# EAGLE design mcuboard (EAGLE 7.1.0)
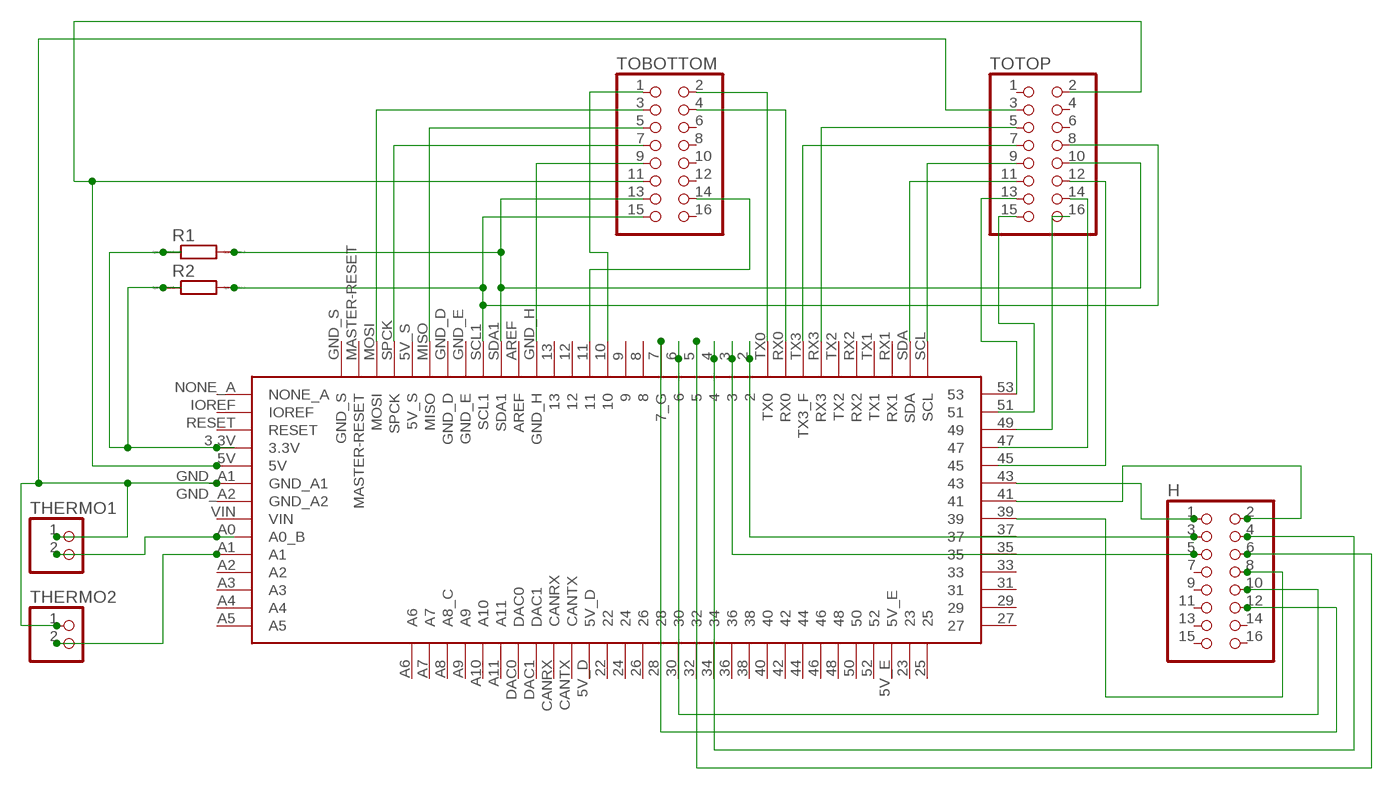
[diagram p0: schematic, sheet 1]

## Parts
H  PINHD-2X8  [2X08]
R1  R-EU_0207_12  [0207/12]
R2  R-EU_0207_12  [0207/12]
THERMO1  PINHD-1X2  [1X02]
THERMO2  PINHD-1X2  [1X02]
TOBOTTOM  PINHD-2X8  [2X08]
TOTOP  PINHD-2X8  [2X08]
U$1  IDUINO1  [IDUINO_PAC]

## Nets
N$1: TOBOTTOM.7 U$1.SPCK
N$2: TOBOTTOM.3 U$1.MOSI
N$3: TOBOTTOM.5 U$1.MISO
N$4: TOBOTTOM.9 U$1.GND_H
N$5: TOBOTTOM.11 TOTOP.2 U$1.5V
N$6: R1.2 TOBOTTOM.13 TOTOP.10 U$1.SDA1
N$7: R2.2 TOBOTTOM.15 TOTOP.8 U$1.SCL1
N$8: TOBOTTOM.2 U$1.TX0
N$9: THERMO1.1 THERMO2.1 TOTOP.3 U$1.GND_A1
N$10: TOBOTTOM.4 U$1.RX0
N$11: TOBOTTOM.14 U$1.11
N$12: TOBOTTOM.1 U$1.10
N$13: TOTOP.5 U$1.RX3
N$14: TOTOP.7 U$1.TX3(TX3_F)
N$15: TOTOP.9 U$1.SCL
N$16: TOTOP.11 U$1.SDA
N$17: R1.1 R2.1 U$1.3.3V
N$18: TOTOP.13 U$1.53
N$19: TOTOP.15
N$20: TOTOP.16 U$1.49
N$21: TOTOP.14
N$22: TOTOP.12
N$23: H.1 U$1.43
N$24: H.8 U$1.39
N$25: H.3 U$1.2
N$26: H.5 U$1.3
N$27: H.4 U$1.4
N$28: THERMO1.2 U$1.A0(A0_B)
N$29: H.2 U$1.41
N$30: H.10 U$1.6
N$31: H.12 U$1.7(7_G)
N$32: THERMO2.2 U$1.A1
N$33: H.6 U$1.5
Unconnected: H.7 H.9 H.11 H.13 H.14 H.15 H.16 TOBOTTOM.6 TOBOTTOM.8 TOBOTTOM.10 TOBOTTOM.12 TOBOTTOM.16 TOTOP.1 TOTOP.4 TOTOP.6 U$1.5V_D U$1.5V_E U$1.5V_S U$1.8 U$1.9 U$1.12 U$1.13 U$1.22 U$1.23 U$1.24 U$1.25 U$1.26 U$1.27 U$1.28 U$1.29 U$1.30 U$1.31 U$1.32 U$1.33 U$1.34 U$1.35 U$1.36 U$1.37 U$1.38 U$1.40 U$1.42 U$1.44 U$1.45 U$1.46 U$1.47 U$1.48 U$1.50 U$1.51 U$1.52 U$1.A2 U$1.A3 U$1.A4 U$1.A5 U$1.A6 U$1.A7 U$1.A8(A8_C) U$1.A9 U$1.A10 U$1.A11 U$1.AREF U$1.CANRX U$1.CANTX U$1.DAC0 U$1.DAC1 U$1.GND_A2 U$1.GND_D U$1.GND_E U$1.GND_S U$1.IOREF U$1.MASTER-RESET U$1.NONE_A U$1.RESET U$1.RX1 U$1.RX2 U$1.TX1 U$1.TX2 U$1.VIN

## Library data of the parts
H TOBOTTOM TOTOP = pinhead:PINHD-2X8: PIN HEADER
R1 R2 = resistor:R-EU_: RESISTOR, European symbol; SPICEPREFIX: R
THERMO1 THERMO2 = pinhead:PINHD-1X2: PIN HEADER
U$1 = iduino:IDUINO

## Board
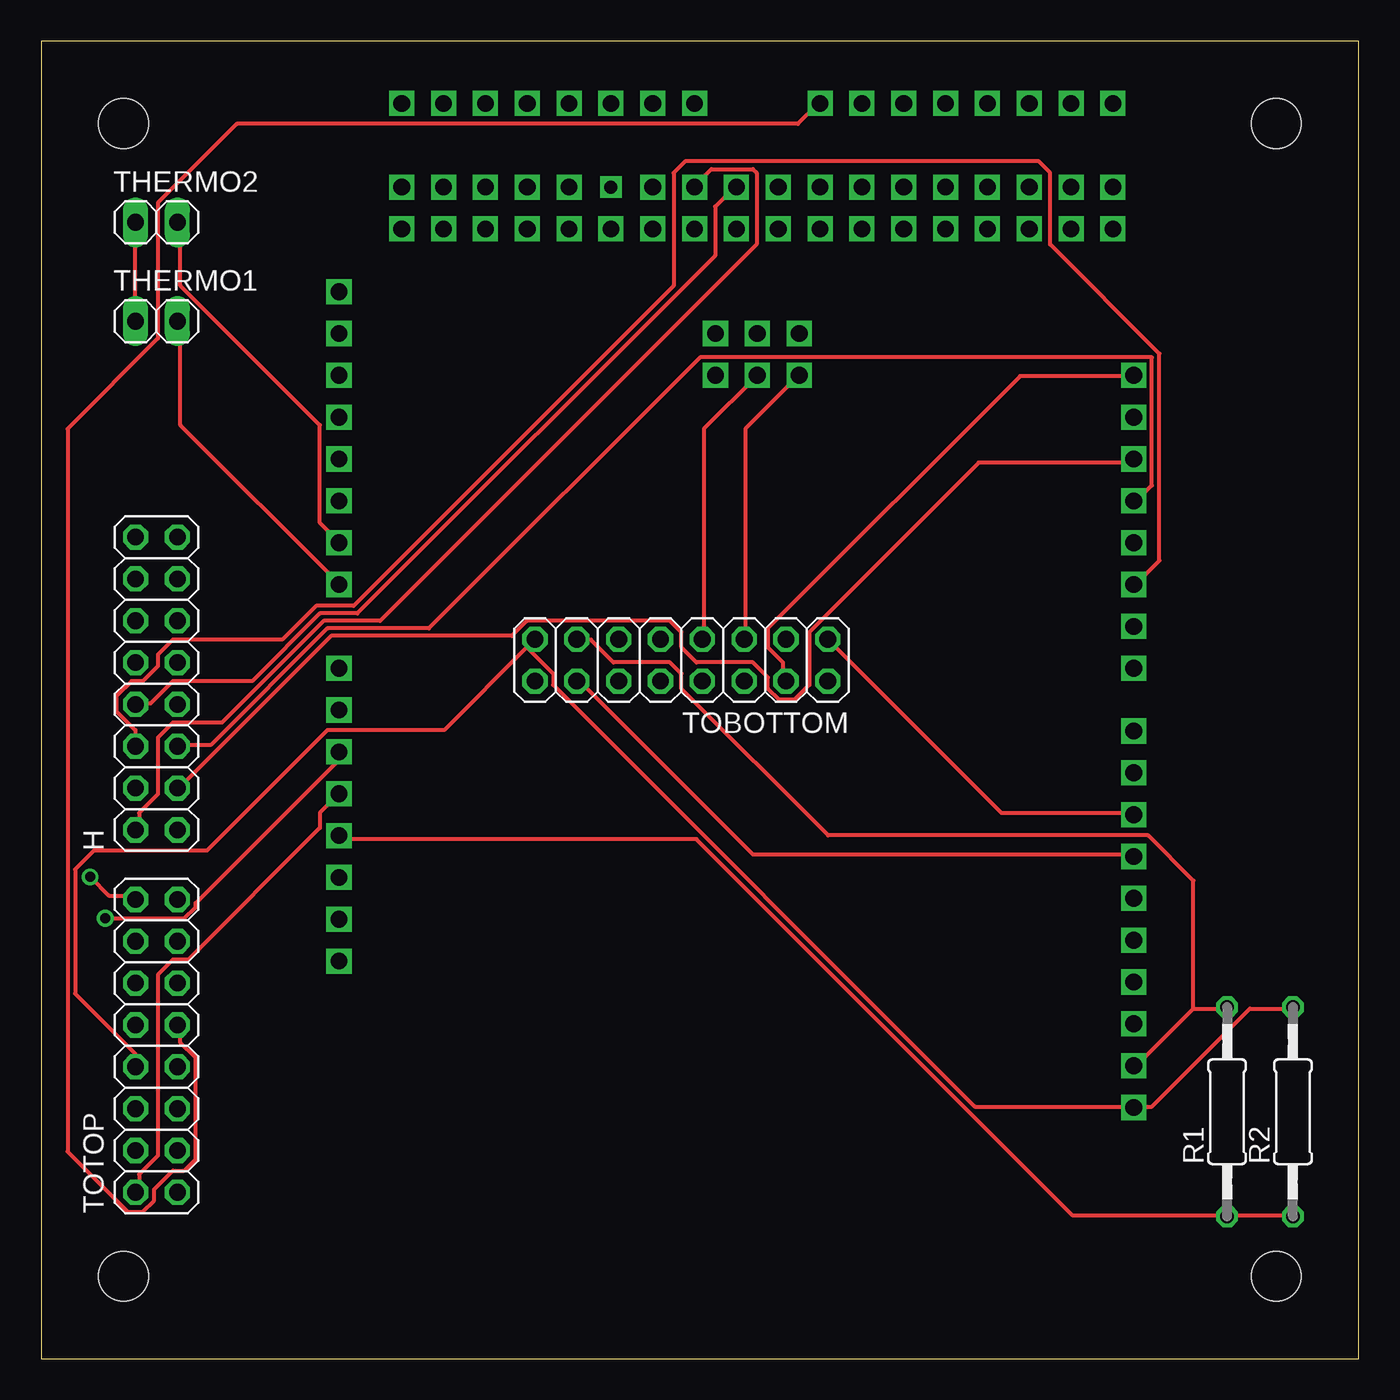
[diagram p1: board, top side]
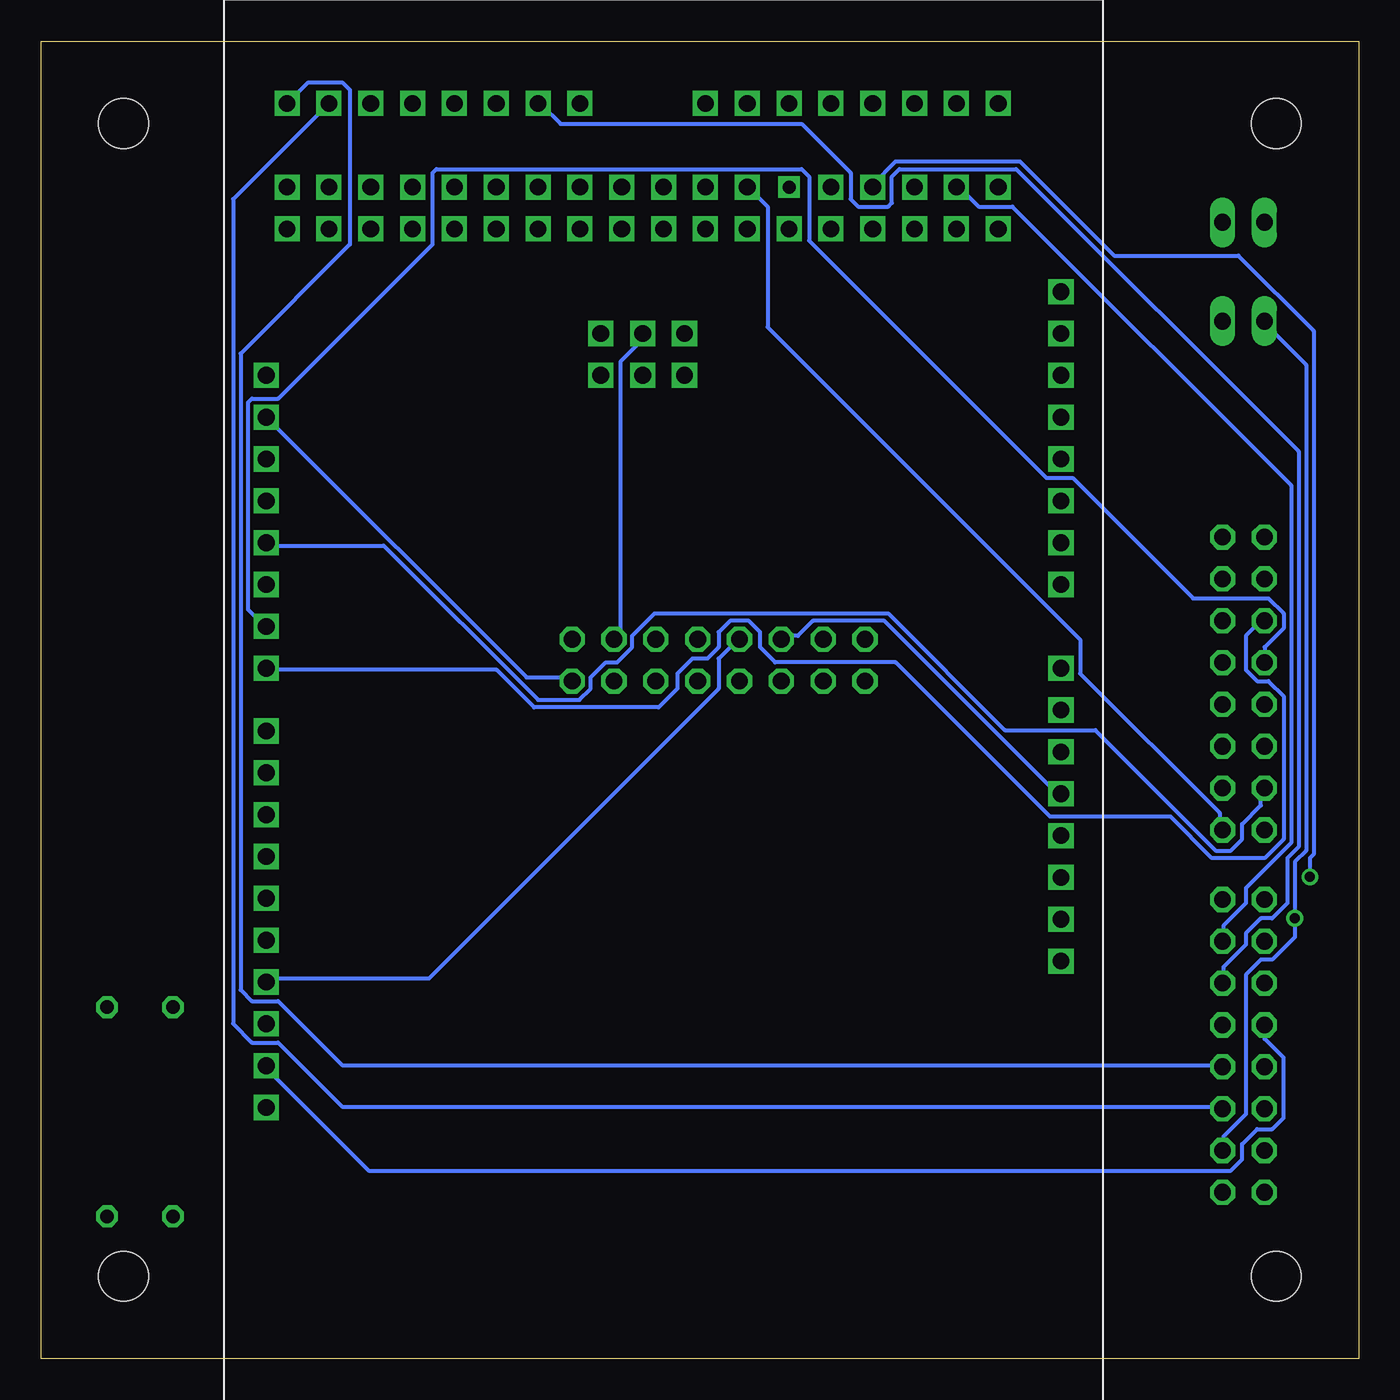
[diagram p2: board, bottom side, seen from below]

Size 80 x 80 mm. Coordinates in mm from the lower left corner, seen from the top.
Outline: 0,0 80,0 80,80 0,80 0,0
Copper layers (1*16): Top 0.035mm / dielectric 1.5mm / Bottom 0.035mm
Design rules "default": minimum track width 10mil, minimum drill 24mil, track to track 8mil, track to pad 8mil, pad to pad 8mil, via to via 8mil, smd to smd 8mil, copper to edge 40mil, drill to drill 8mil, minimum pad ring 10mil, minimum via ring 8mil, stop-mask expansion 4mil, vias tented up to drill 0mil, thermal gap 10mil
Holes 3 mm at 5,75 75,75 75,5 5,5

### Footprints (pad centres in the part's own frame; a part is rotated, then mirrored left to right if it is on the bottom)
2X08 = drill 1.016 octagon: 1 -8.89,-1.27; 2 -8.89,1.27; 3 -6.35,-1.27; 4 -6.35,1.27; 5 -3.81,-1.27; 6 -3.81,1.27; 7 -1.27,-1.27; 8 -1.27,1.27; 9 1.27,-1.27; 10 1.27,1.27; 11 3.81,-1.27; 12 3.81,1.27; 13 6.35,-1.27; 14 6.35,1.27; 15 8.89,-1.27; 16 8.89,1.27
0207/12 = drill 0.813 octagon: 1 -6.35,0; 2 6.35,0
1X02 = drill 1.016 long: 1 -1.27,0; 2 1.27,0
IDUINO_PAC = drill 1.016 square: 2 12.7,6.35; 3 10.16,6.35; 3.3V -10.16,-41.91; 4 7.62,6.35; 5 5.08,6.35; 5V -7.62,-41.91; 5V_D 26.67,5.08; 5V_E 29.21,5.08; 5V_S 20.32,-13.97; 6 2.54,6.35; 7 0,6.35; 8 -3.81,6.35; 9 -6.35,6.35; 10 -8.89,6.35; 11 -11.43,6.35; 12 -13.97,6.35; 13 -16.51,6.35; 22 26.67,2.54; 23 29.21,2.54; 24 26.67,0; 25 29.21,0; 26 26.67,-2.54; 27 29.21,-2.54; 28 26.67,-5.08; 29 29.21,-5.08; 30 26.67,-7.62; 31 29.21,-7.62; 32 26.67,-10.16; 33 29.21,-10.16; 34 26.67,-12.7; 35 29.21,-12.7; 36 26.67,-15.24; 37 29.21,-15.24; 38 26.67,-17.78; 39 29.21,-17.78; 40 26.67,-20.32; 41 29.21,-20.32; 42 26.67,-22.86; 43 29.21,-22.86; 44 26.67,-25.4; 46 26.67,-27.94; 47 29.21,-27.94; 48 26.67,-30.48; 49 29.21,-30.48; 50 26.67,-33.02; 51 29.21,-33.02; 52 26.67,-35.56; 53 29.21,-35.56; A0 5.08,-41.91; A1 7.62,-41.91; A2 10.16,-41.91; A3 12.7,-41.91; A4 15.24,-41.91; A5 17.78,-41.91; A6 20.32,-41.91; A7 22.86,-41.91; A8 34.29,-38.1; A9 34.29,-35.56; A10 34.29,-33.02; A11 34.29,-30.48; AREF -21.59,6.35; CANRX 34.29,-22.86; CANTX 34.29,-20.32; DAC0 34.29,-27.94; DAC1 34.29,-25.4; GND_A1 -5.08,-41.91; GND_A2 -2.54,-41.91; GND_D 26.67,-38.1; GND_E 29.21,-38.1; GND_H -19.05,6.35; GND_S 20.32,-19.05; IOREF -15.24,-41.91; MASTER-RESET 17.78,-19.05; MISO 17.78,-13.97; MOSI 20.32,-16.51; NONE_A -17.78,-41.91; RESET -12.7,-41.91; RX0 17.78,6.35; RX1 34.29,-7.62; RX2 34.29,-2.54; RX3 34.29,2.54; SCL 34.29,-12.7; SCL1 -26.67,6.35; SDA 34.29,-10.16; SDA1 -24.13,6.35; SPCK 17.78,-16.51; TX0 15.24,6.35; TX1 34.29,-5.08; TX2 34.29,0; TX3 34.29,5.08; VIN 0,-41.91 | drill 0.8 square: 45 29.21,-25.4

### Placement (x,y rotation side)
H  7,41 90 top
R1  72,15 90 top
R2  76,15 90 top
THERMO1  7,63 0 top
THERMO2  7,69 0 top
TOBOTTOM  38.87,42.42 180 top
TOTOP  7,19 90 top
U$1  59.99,41.93 90 bottom

### Tracks (layer width: path | path; a pad name or v marks a point on that pad's centre or on a via)
N$1
  Top 0.254: TOBOTTOM.7 40.23,43.89 40.23,56.46 43.43,59.66 U$1.SPCK
N$2
  Bottom 0.254: U$1.MOSI 43.66,62.18 43.66,61.72 44.81,60.58 44.81,44.12 45.03,43.89 TOBOTTOM.3
N$3
  Top 0.254: TOBOTTOM.5 42.75,43.89 42.75,56.46 45.95,59.66 U$1.MISO
N$4
  Bottom 0.254: U$1.GND_H 66.29,23.09 56.46,23.09 38.86,40.69 38.86,42.52 37.72,43.66 TOBOTTOM.9
N$5
  Top 0.254: TOTOP.2 5.94,10.29 5.94,11.2 7.09,12.34 7.09,23.32 8,24.23 8.91,24.23 16.92,32.23 16.92,33.15 18.06,34.29 U$1.5V
  Bottom 0.254: TOBOTTOM.11 34.98,43.89 34.06,43.89 33.15,44.81 28.8,44.81 18.29,34.29 U$1.5V
N$6
  Top 0.254: 69.95,21.26 71.78,21.26 R1.2 | 69.95,21.26 66.52,17.83 U$1.SDA1 | 69.95,21.26 69.95,29.03 67.21,31.77 47.78,31.77 38.86,40.69 38.86,41.6 38.18,42.29 34.75,42.29 33.38,43.66 32.69,43.66 TOBOTTOM.13
  Bottom 0.254: TOTOP.10 5.71,20.12 5.71,19.43 4.57,18.29 4.57,14.63 5.26,13.95 6.17,13.95 7.09,13.03 7.09,12.12 7.77,11.43 60.12,11.43 66.29,17.6 U$1.SDA1
N$7
  Top 0.254: R2.2 75.89,21.26 73.38,21.26 67.44,15.32 66.52,15.32 U$1.SCL1 66.29,15.32 56.69,15.32 31.09,40.92 31.09,41.6 29.49,43.2 | 29.49,43.2 29.95,43.66 TOBOTTOM.15 29.49,43.2 | 29.49,43.2 24.46,38.18 17.37,38.18 10.06,30.86 3.2,30.86 2.06,29.72 2.06,22.17 5.71,18.52 5.71,17.83 TOTOP.8
N$8
  Bottom 0.254: TOBOTTOM.2 47.78,41.38 50.52,41.38 66.29,57.15 U$1.TX0
N$9  (via drill 0.61)
  Top 0.254: v3.89,26.75 8.69,26.75 9.37,27.43 9.37,27.66 18.06,36.35 18.06,36.8 U$1.GND_A1 | THERMO2.1 5.71,68.81 5.71,63.09 THERMO1.1
  Bottom 0.254: TOTOP.3 8.23,12.8 8.23,13.49 6.86,14.86 6.86,23.32 5.94,24.23 5.26,24.23 3.89,25.6 v3.89,26.75 3.89,30.18 3.2,30.86 3.2,60.35 5.71,62.87 THERMO1.1
N$10
  Top 0.254: TOBOTTOM.4 45.03,41.38 45.03,42.29 44.12,43.2 44.12,44.35 59.44,59.66 66.29,59.66 U$1.RX0
N$11
  Top 0.254: U$1.11 66.29,30.63 43.2,30.63 32.69,41.15 TOBOTTOM.14
N$12
  Top 0.254: U$1.10 66.29,33.15 58.29,33.15 47.78,43.66 TOBOTTOM.1
N$13
  Bottom 0.254: TOTOP.5 8.46,15.32 61.72,15.32 65.61,19.2 67.21,19.2 68.35,20.34 68.35,70.41 62.64,76.12 U$1.RX3
N$14
  Bottom 0.254: TOTOP.7 8.46,17.83 61.72,17.83 65.61,21.72 67.21,21.72 67.89,22.4 67.89,61.04 61.27,67.67 61.27,77.04 61.72,77.5 63.78,77.5 64.92,76.35 U$1.TX3
N$15
  Top 0.254: TOTOP.9 8.46,20.12 8.46,19.2 9.37,18.29 9.37,12.12 8.69,11.43 8,11.43 6.86,10.29 6.86,9.6 6.17,8.91 5.26,8.91 1.6,12.57 1.6,56.46 7.09,61.95 7.09,70.18 11.89,74.98 45.95,74.98 47.09,76.12 U$1.SCL
N$16
  Bottom 0.254: TOTOP.11 8.23,22.86 8.23,23.77 6.86,25.15 6.86,25.83 5.94,26.75 5.26,26.75 4.34,27.66 4.34,30.4 3.66,31.09 3.66,55.09 20.8,72.24 27.89,72.24 28.35,71.78 28.35,70.18 28.57,69.95 30.4,69.95 30.86,70.41 30.86,72.01 33.83,74.98 48.46,74.98 49.61,76.12 U$1.SDA
N$17
  Top 0.254: R2.1 75.89,8.69 72.01,8.69 R1.1 71.78,8.69 62.64,8.69 39.78,31.55 18.29,31.55 U$1.3.3V
N$18
  Bottom 0.254: TOTOP.13 8.23,25.38 8.23,26.29 6.86,27.66 6.86,28.57 4.12,31.32 4.12,53.03 21.03,69.95 23.09,69.95 24.23,71.09 U$1.53
N$20  (via drill 0.61)
  Top 0.254: v2.97,29.26 4.12,28.12 5.71,28.12 TOTOP.16
  Bottom 0.254: v2.97,29.26 2.97,30.4 2.74,30.63 2.74,62.41 7.32,66.98 14.86,66.98 20.57,72.69 28.12,72.69 29.49,71.32 U$1.49
N$23
  Bottom 0.254: H.1 8.46,32.23 8.46,33.15 16.92,41.6 16.92,43.66 35.89,62.64 35.89,69.95 37.03,71.09 U$1.43
N$24
  Top 0.254: H.8 5.94,39.78 6.63,39.78 8,41.15 12.8,41.15 16.92,45.26 19.2,45.26 40.92,66.98 40.92,69.95 42.06,71.09 U$1.39
N$25
  Top 0.254: H.3 8.46,34.75 17.6,43.89 28.57,43.89 29.49,44.81 38.18,44.81 38.86,44.12 38.86,43.2 39.78,42.29 43.2,42.29 44.12,41.38 44.12,40.69 44.81,40.01 45.72,40.01 46.63,40.92 46.63,44.12 56.92,54.41 66.29,54.41 U$1.2
N$26
  Top 0.254: H.5 8.46,37.26 10.29,37.26 17.37,44.35 23.55,44.35 40.01,60.81 67.44,60.81 67.44,53.03 66.52,52.12 U$1.3
N$27
  Bottom 0.254: H.4 5.94,34.52 5.94,33.6 7.09,32.46 7.09,31.55 7.77,30.86 8.69,30.86 16,38.18 21.49,38.18 28.57,45.26 42.75,45.26 44.12,43.89 44.12,43.2 45.03,42.29 45.72,42.29 46.63,41.38 46.63,40.69 47.32,40.01 49.84,40.01 59.21,49.38 66.29,49.38 U$1.4
N$28
  Top 0.254: THERMO1.2 8.46,62.87 8.46,56.69 18.06,47.09 U$1.A0
N$29
  Top 0.254: H.2 5.94,32.23 5.94,33.15 7.09,34.29 7.09,37.72 8,38.63 10.97,38.63 17.14,44.81 20.57,44.81 43.43,67.67 43.43,72.01 43.2,72.24 40.69,72.24 39.78,71.32 U$1.41
N$30
  Bottom 0.254: H.10 5.71,42.29 5.71,43.2 4.57,44.35 4.57,45.26 5.49,46.18 10.06,46.18 17.37,53.49 18.97,53.49 33.38,67.89 33.38,71.78 33.83,72.24 56.01,72.24 56.24,72.01 56.24,67.67 65.61,58.29 67.21,58.29 67.44,58.06 67.44,45.49 66.52,44.58 U$1.6
N$31
  Bottom 0.254: U$1.7 66.29,41.83 52.35,41.83 50.06,39.55 42.52,39.55 41.38,40.69 41.38,41.6 40.46,42.52 39.55,42.52 38.86,43.2 38.86,44.12 38.18,44.81 37.03,44.81 36.35,44.12 36.35,43.2 35.43,42.29 28.12,42.29 18.75,32.92 11.43,32.92 8.91,30.4 5.71,30.4 4.57,31.55 4.57,40.23 5.49,41.15 6.17,41.15 6.86,41.83 6.86,43.89 5.94,44.81 H.12
N$32
  Top 0.254: THERMO2.2 8.46,68.81 8.46,65.15 16.92,56.69 16.92,50.75 18.06,49.61 U$1.A1
N$33
  Top 0.254: H.6 5.71,37.26 5.71,38.18 4.57,39.32 4.57,40.23 5.49,41.15 6.17,41.15 7.09,42.06 7.09,42.75 8,43.66 14.63,43.66 16.69,45.72 18.97,45.72 38.41,65.15 38.41,72.01 39.09,72.69 60.58,72.69 61.27,72.01 61.27,67.67 67.89,61.04 67.89,48.46 66.52,47.09 U$1.5